# Altium project BABA03A.PrjPcb
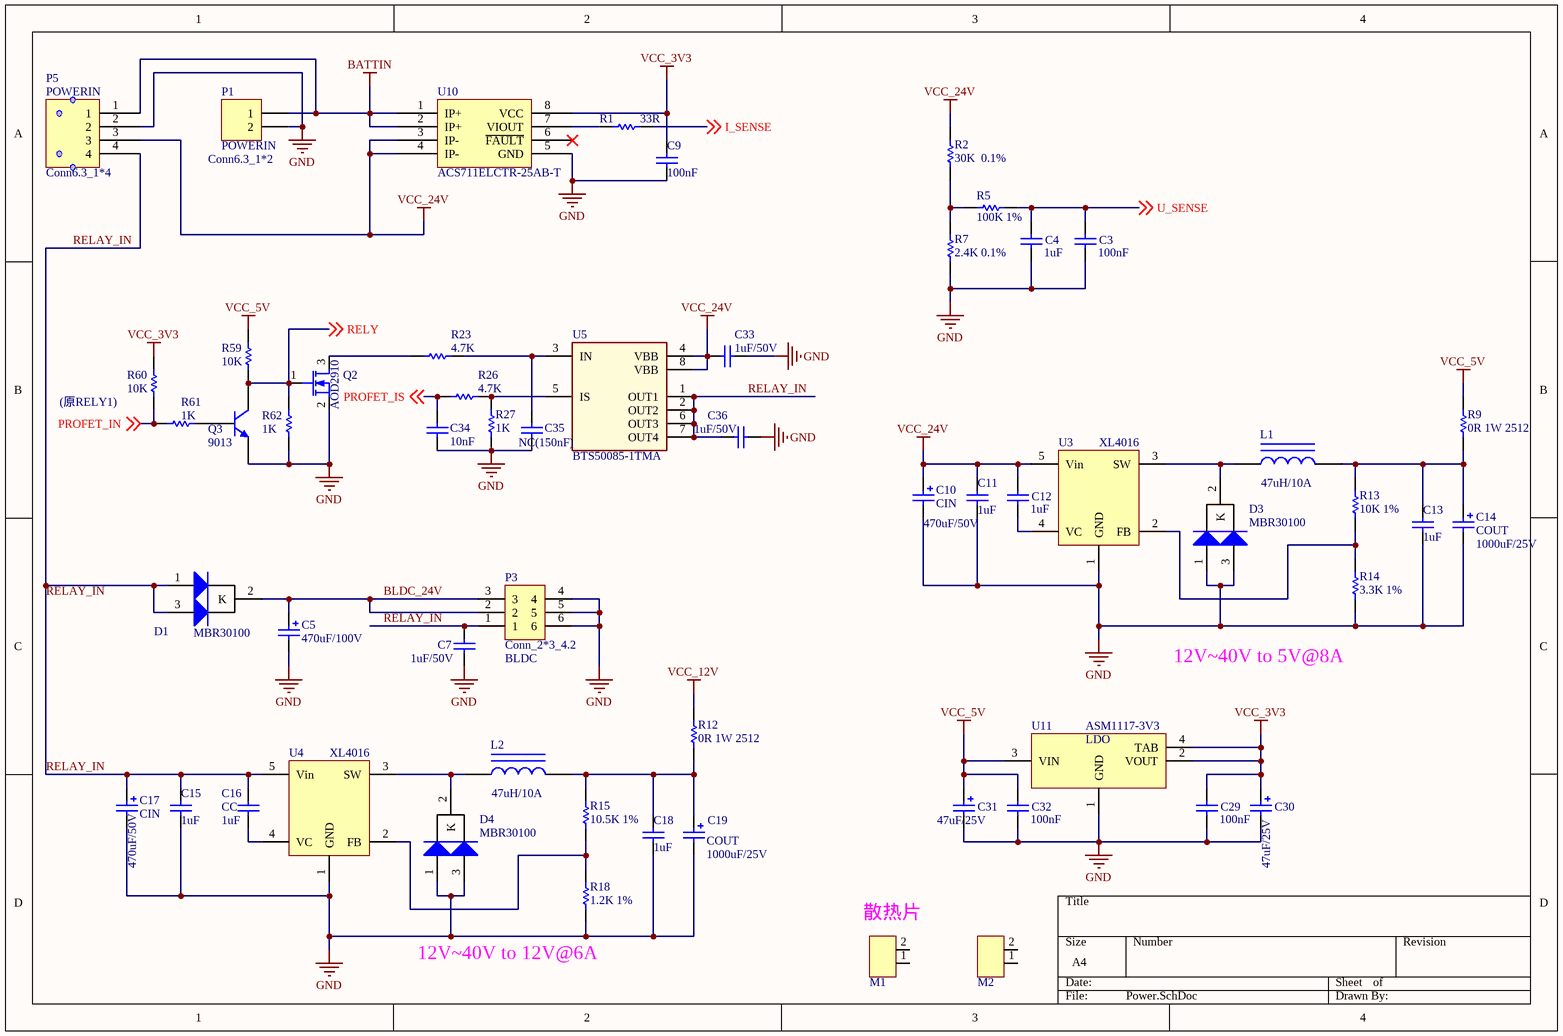
[diagram p0: Power.SchDoc]
3 sheets, 178 parts. Net scope: global (net labels, ports and power ports of the same name join across sheets).
Board file: BABA03A.PcbDoc
Sheets:
  Power.SchDoc
  Mcu.SchDoc
  Connector.SchDoc

## Sheet Power.SchDoc
size A4

### Parts
C3  value 100nF  [C0805]  (hidden comment: Cap)
C4  value 1uF  [C0805]  (hidden comment: Cap)
C5  value 470uF/100V  [330uF]  (hidden comment: Cap Pol1)
C7  value 1uF/50V  [C0805]  (hidden comment: Cap)
C9  value 100nF  [C0805]  (hidden comment: Cap)
C10  CIN  value 470uF/50V  [CTH-R5-D5]
C11  value 1uF  [C0805]  (hidden comment: Cap)
C12  value 1uF  [C0805]  (hidden comment: Cap)
C13  value 1uF  [C0805]  (hidden comment: Cap)
C14  COUT  value 1000uF/25V  [CTH-R5-D5]
C15  value 1uF  [C0805]  (hidden comment: Cap)
C16  value 1uF  [C0805]  (hidden comment: Cap)
C17  CIN  value 470uF/50V  [CTH-R5-D5]
C18  value 1uF  [C0805]  (hidden comment: Cap)
C19  COUT  value 1000uF/25V  [CTH-R5-D5]
C29  value 100nF  [C0805]  (hidden comment: Cap)
C30  value 47uF/25V  [CTH-R3-D2.54]  (hidden comment: Cap Pol1)
C31  value 47uF/25V  [CTH-R3-D2.54]  (hidden comment: Cap Pol1)
C32  value 100nF  [C0805]  (hidden comment: Cap)
C33  value 1uF/50V  [C0805]  (hidden comment: Cap)
C34  value 10nF  [C0805]  (hidden comment: Cap)
C35  value NC(150nF)  [C0805]  (hidden comment: Cap)
C36  value 1uF/50V  [C0805]  (hidden comment: Cap)
D1  MBR30100  [TO-263-3]
D3  MBR30100  [TO-263-3]
D4  MBR30100  [TO-263-3]
L1  value 47uH/10A  [L2210]  (hidden comment: Inductor Iron)
L2  value 47uH/10A  [L2210]  (hidden comment: Inductor Iron)
M1  SRP  [SRP-2-15*10]  (value not drawn)
M2  SRP  [SRP-2-15*10]  (value not drawn)
P1  POWERIN  [DIP2*6.3]
P3  Conn_2*3_4.2  Conn4.2: BLDC  [PIN2X3_4.2]
P5  POWERIN  [PORT-SIP4-6.3-LOCK]
Q2  AOD2910  [TO252-D]
Q3  9013  [BCY-W3/E4]
R1  value 33R  [R0805]  (hidden comment: Res1)
R2  value 30K  0.1%  [R0805]  (hidden comment: Res1)
R5  value 100K 1%  [R0805]  (hidden comment: Res1)
R7  value 2.4K 0.1%  [R0805]  (hidden comment: Res1)
R9  value 0R 1W 2512  [2512]  (hidden comment: Res1)
R12  value 0R 1W 2512  [2512]  (hidden comment: Res1)
R13  value 10K 1%  [R0805]  (hidden comment: Res1)
R14  value 3.3K 1%  [R0805]  (hidden comment: Res1)
R15  value 10.5K 1%  [R0805]  (hidden comment: Res1)
R18  value 1.2K 1%  [R0805]  (hidden comment: Res1)
R23  value 4.7K  [R0805]  (hidden comment: Res1)
R26  value 4.7K  [R0805]  (hidden comment: Res1)
R27  value 1K  [R0805]  (hidden comment: Res1)
R59  value 10K  [R0805]  (hidden comment: Res1)
R60  value 10K  [R0805]  (hidden comment: Res1)
R61  value 1K  [R0805]  (hidden comment: Res1)
R62  value 1K  [R0805]  (hidden comment: Res1)
U3  XL4016  [TO220-5]
U4  XL4016  [TO220-5]
U5  BTS50085-1TMA  [TO127P1385X450-8N-V]
U10  ACS711ELCTR-25AB-T  [ACS712-SOIC8]
U11  ASM1117-3V3  [ASM1117-3V3]

### Nets
BATTIN: P1.1 P5.1 U10.1(IP+) U10.2(IP+)
GND: C3.1 C4.1 C5.2 C7.2 C9.1 C10.2 C11.1 C13.1 C14.2 C15.1 C17.2 C18.1 C19.2 C29.1 C30.2 C31.2 C32.1 C33.1 C34.2 C35.2 C36.1 D3.1(A) D3.3(A) D4.1(A) D4.3(A) P1.2 P3.4 P3.5 P3.6 P5.2 Q2.2(S) Q3.1(E) R7.2 R14.2 R18.2 R27.1 R62.2 U3.1(GND) U4.1(GND) U10.5(GND) U11.1(GND)
VCC_3V3: C9.2 C29.2 C30.1 R60.1 U10.8(VCC) U11.2(VOUT) U11.4(TAB)
VCC_5V: C31.1 C32.2 R9.1 R59.1 U11.3(VIN)
VCC_12V: R12.1
VCC_24V: C10.1 C11.2 C12.2 C33.2 P5.3 R2.1 U3.5(Vin) U5.4(VBB) U5.8(VBB) U10.3(IP-) U10.4(IP-)
BLDC_24V: C5.1 D1.2(K) P3.2 P3.3
I_SENSE: R1.1 ; off-sheet I_SENSE
PROFET_IN: R60.2 R61.2 ; off-sheet PROFET_IN
PROFET_IS: C34.1 R26.1 ; off-sheet PROFET_IS
RELAY_IN: C7.1 C15.2 C16.2 C17.1 C36.2 D1.1(A) D1.3(A) P3.1 P5.4 U4.5(Vin) U5.1(OUT1) U5.2(OUT2) U5.6(OUT3) U5.7(OUT4)
RELY: Q2.1(G) Q3.3(C) R59.2 R62.1 ; off-sheet RELY
U_SENSE: C3.2 C4.2 R5.2 ; off-sheet U_SENSE
NetC12_1: C12.1 U3.4(VC)
NetC13_2: C13.2 C14.1 L1.2 R9.2 R13.1
NetC16_1: C16.1 U4.4(VC)
NetC18_2: C18.2 C19.1 L2.2 R12.2 R15.1
NetC35_1: C35.1 R23.2 U5.3(IN)
NetD3_2: D3.2(K) L1.1 U3.3(SW)
NetD4_2: D4.2(K) L2.1 U4.3(SW)
NetQ2_3: Q2.3(D) R23.1
NetQ3_2: Q3.2(B) R61.1
NetR1_2: R1.2 U10.7(VIOUT)
NetR2_2: R2.2 R5.1 R7.1
NetR13_2: R13.2 R14.1 U3.2(FB)
NetR15_2: R15.2 R18.1 U4.2(FB)
NetR26_2: R26.2 R27.2 U5.5(IS)

Not connected (* = marked no-connect by the designer): M1 1 2; M2 1 2; U10 6(~{FAULT})*

### Notes on the sheet
- (near P1) Conn6.3_1*2
- (原RELY1)
- 12V~40V to 5V@8A
- (near C16) CC
- (near M1) 散热片
- (near R18) 12V~40V to 12V@6A
- (in symbol CONN_4PIN) Conn6.3_1*4

### Library data of the parts
C3 C4 C7 C9 C11-C13 C15 C18 C29 C32-C36 = Cap: Capacitor; Published: 8-Jun-2000; LatestRevisionDate: 17-Jul-2002; LatestRevisionNote: Re-released for DXP Platform.; PackageReference: RAD-0.3; Publisher: Altium Limited; PackageDescription: Radial Cap, Thru-Hole; 2 Leads; 0.3 in Pin Spacing
C5 C10 C14 C17 C19 C30 C31 = Cap Pol1: Polarized Capacitor (Radial); Published: 8-Jun-2000; LatestRevisionDate: 17-Jul-2002; LatestRevisionNote: Re-released for DXP Platform.; PackageReference: RB7.6-15; Publisher: Altium Limited; PackageDescription: Polarized Capacitor (Radial); 2 Leads
C16 = Cap: CC; Published: 8-Jun-2000; LatestRevisionDate: 17-Jul-2002; LatestRevisionNote: Re-released for DXP Platform.; PackageReference: RAD-0.3; Publisher: Altium Limited; PackageDescription: Radial Cap, Thru-Hole; 2 Leads; 0.3 in Pin Spacing
D1 D3 D4 = MBR30100: Dual Diode; Published: 8-Jun-2000; LatestRevisionDate: 17-Jul-2002; LatestRevisionNote: Re-released for DXP Platform.; PackageVersion: Sep-1996; PackageReference: SMC; Publisher: Altium Limited; PackageDescription: DO-214-AB/SMC; 2 C-Bend Leads; Body 7.9 x 5.9 mm, inc. leads (LxW); Code_JEDEC: DO-214-AB
L1 L2 = Inductor Iron: Magnetic-Core Inductor; Published: 24-Mar-1999; LatestRevisionDate: 17-Jul-2002; LatestRevisionNote: Re-released for DXP Platform.; PackageReference: AXIAL-0.9; Publisher: Altium Limited; PackageDescription: Axial Device, Thru-Hole; 2 Leads; 0.9 in Pin Spacing
M1 M2 = SRP-1
P1 = Header 2: Conn6.3_1*2
P5 = CONN_4PIN
Q2 = MOSFET-N: N-Channel MOSFET; Published: 8-Jun-2000; LatestRevisionDate: 17-Jul-2002; LatestRevisionNote: Re-released for DXP Platform.; PackageVersion: 1995/1996; PackageReference: E3; Publisher: Altium Limited; Value: AOD2910
Q3 = 2N3904: NPN General Purpose Amplifier; Published: 8-Jun-2000; LatestRevisionDate: 15-Jan-2003; LatestRevisionNote: PCB Footprint 'BCY-W3/D4.7' replaced; DatasheetVersion: 1997; PackageVersion: Sep-1998; PackageReference: TO-92A; Publisher: Altium Limited; Code_JEDEC: TO-92A; ComponentLink1Description: Manufacturer Link; ComponentLink1URL: http://www.fairchildsemi.com/; ComponentLink2Description: Datasheet; ComponentLink2URL: http://www.fairchildsemi.com/ds/2N%2F2N3904.pdf
R1 R2 R5 R7 R9 R12-R15 R18 R23 R26 R27 R59-R62 = Res1: Resistor; Published: 8-Jun-2000; LatestRevisionDate: 17-Jul-2002; LatestRevisionNote: Re-released for DXP Platform.; PackageReference: AXIAL-0.3; Publisher: Altium Limited; PackageDescription: Axial Device, Thru-Hole; 2 Leads; 0.3 in Pin Spacing
U3 U4 = XL4016: BUCK DCDC; Published: 24-Mar-1999; LatestRevisionDate: 29-May-2009; LatestRevisionNote: IPC-7351 Footprint Added.; PackageReference: D2PAK; Publisher: Altium Limited; PackageDescription: 3-Pin Transistor Outline Package 2.54 mm Pitch, 15.1 mm Lead Span
U5 = BTS50085-1TMA: Smart Highside High Current Power Switch, VBB 70V; Manufacturer: Infineon Technologies; ManufacturerPartNumber: BTS50085-1TMA; PackageReference: PG-TO220-7-4
U10 = ACS711
U11 = LDO

## Sheet Mcu.SchDoc
size A4
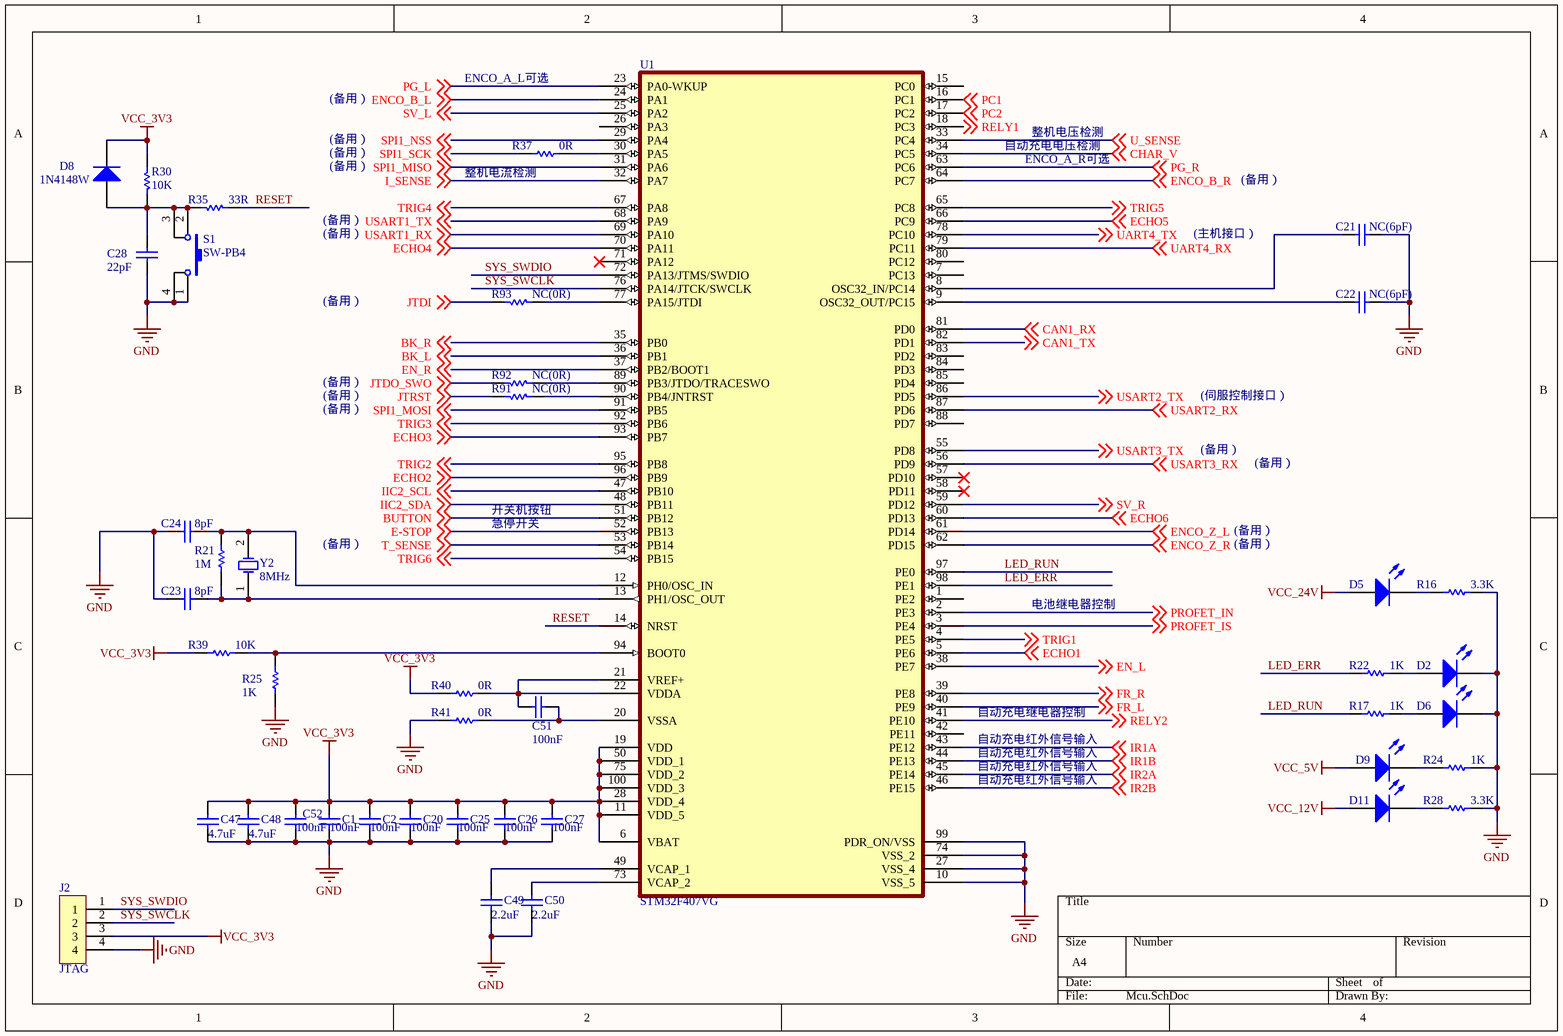
[diagram p1: Mcu.SchDoc]

### Parts
C1  value 100nF  [C0805]  (hidden comment: Cap)
C2  value 100nF  [C0805]  (hidden comment: Cap)
C20  value 100nF  [C0805]  (hidden comment: Cap)
C21  NC(6pF)  [C0805]
C22  NC(6pF)  [C0805]
C23  8pF  [C0805]
C24  8pF  [C0805]
C25  value 100nF  [C0805]  (hidden comment: Cap)
C26  value 100nF  [C0805]  (hidden comment: Cap)
C27  value 100nF  [C0805]  (hidden comment: Cap)
C28  value 22pF  [C0805]  (hidden comment: Cap)
C47  value 4.7uF  [C0805]  (hidden comment: Cap)
C48  value 4.7uF  [C0805]  (hidden comment: Cap)
C49  value 2.2uF  [C0805]  (hidden comment: Cap)
C50  value 2.2uF  [C0805]  (hidden comment: Cap)
C51  value 100nF  [C0805]  (hidden comment: Cap)
C52  value 100nF  [C0805]  (hidden comment: Cap)
D2  LED0  [LED-H-R2.54]  (value not drawn)
D5  LED0  [LED-H-R2.54]  (value not drawn)
D6  LED0  [LED-H-R2.54]  (value not drawn)
D8  value 1N4148W  [1206]  (hidden comment: Diode)
D9  LED0  [LED-H-R2.54]  (value not drawn)
D11  LED0  [LED-H-R2.54]  (value not drawn)
J2  JTAG  [PORT-SIP4-2.54]
R16  value 3.3K  [R0805]  (hidden comment: Res1)
R17  value 1K  [R0805]  (hidden comment: Res1)
R21  value 1M  [R0805]  (hidden comment: Res1)
R22  value 1K  [R0805]  (hidden comment: Res1)
R24  value 1K  [R0805]  (hidden comment: Res1)
R25  value 1K  [R0805]  (hidden comment: Res1)
R28  value 3.3K  [R0805]  (hidden comment: Res1)
R30  value 10K  [R0805]  (hidden comment: Res1)
R35  value 33R  [R0805]  (hidden comment: Res1)
R37  value 0R  [R0805]  (hidden comment: Res1)
R39  value 10K  [R0805]  (hidden comment: Res1)
R40  value 0R  [R0805]  (hidden comment: Res1)
R41  value 0R  [R0805]  (hidden comment: Res1)
R91  value NC(0R)  [R0805]  (hidden comment: Res1)
R92  value NC(0R)  [R0805]  (hidden comment: Res1)
R93  value NC(0R)  [R0805]  (hidden comment: Res1)
S1  SW-PB4  [RESET-SMD-1O4]
U1  STM32F407VG  [100T1_N]
Y2  8MHz  [CLK_3.1]

### Nets
GND: C1.2 C2.2 C20.2 C21.1 C22.1 C23.2 C24.2 C25.2 C26.2 C27.2 C28.1 C47.2 C48.2 C49.2 C50.2 C52.2 D2.2(K) D6.2(K) J2.4 R16.1 R24.1 R25.1 R28.1 R41.2 S1.1 S1.4 U1.10(VSS_5) U1.27(VSS_4) U1.74(VSS_2) U1.99(PDR_ON/VSS)
VCC_3V3: C1.1 C2.1 C20.1 C25.1 C26.1 C27.1 C47.1 C48.1 C52.1 D8.2(K) J2.3 R30.2 R39.2 R40.2 U1.6(VBAT) U1.11(VDD_5) U1.19(VDD) U1.28(VDD_4) U1.50(VDD_1) U1.75(VDD_2) U1.100(VDD_3)
VCC_5V: D9.1(A)
VCC_12V: D11.1(A)
VCC_24V: D5.1(A)
BK_L: U1.36(PB1) ; off-sheet BK_L
BK_R: U1.35(PB0) ; off-sheet BK_R
BUTTON: U1.51(PB12) ; off-sheet BUTTON
CAN1_RX: U1.81(PD0) ; off-sheet CAN1_RX
CAN1_TX: U1.82(PD1) ; off-sheet CAN1_TX
CHAR_V: U1.34(PC5) ; off-sheet CHAR_V
E-STOP: U1.52(PB13) ; off-sheet E-STOP
ECHO1: U1.5(PE6) ; off-sheet ECHO1
ECHO2: U1.96(PB9) ; off-sheet ECHO2
ECHO3: U1.93(PB7) ; off-sheet ECHO3
ECHO4: U1.70(PA11) ; off-sheet ECHO4
ECHO5: U1.66(PC9) ; off-sheet ECHO5
ECHO6: U1.60(PD13) ; off-sheet ECHO6
EN_L: U1.38(PE7) ; off-sheet EN_L
EN_R: U1.37(PB2/BOOT1) ; off-sheet EN_R
ENCO_B_L: U1.24(PA1) ; off-sheet ENCO_B_L
ENCO_B_R: U1.64(PC7) ; off-sheet ENCO_B_R
ENCO_Z_L: U1.61(PD14) ; off-sheet ENCO_Z_L
ENCO_Z_R: U1.62(PD15) ; off-sheet ENCO_Z_R
FR_L: U1.40(PE9) ; off-sheet FR_L
FR_R: U1.39(PE8) ; off-sheet FR_R
I_SENSE: U1.32(PA7) ; off-sheet I_SENSE
IIC2_SCL: U1.47(PB10) ; off-sheet IIC2_SCL
IIC2_SDA: U1.48(PB11) ; off-sheet IIC2_SDA
IR1A: U1.43(PE12) ; off-sheet IR1A
IR1B: U1.44(PE13) ; off-sheet IR1B
IR2A: U1.45(PE14) ; off-sheet IR2A
IR2B: U1.46(PE15) ; off-sheet IR2B
JTDI: R93.2 ; off-sheet JTDI
JTDO_SWO: R92.2 ; off-sheet JTDO_SWO
JTRST: R91.2 ; off-sheet JTRST
LED_ERR: R22.2 U1.98(PE1)
LED_RUN: R17.2 U1.97(PE0)
PC1: U1.16(PC1) ; off-sheet PC1
PC2: U1.17(PC2) ; off-sheet PC2
PG_L: U1.23(PA0-WKUP) ; off-sheet PG_L
PG_R: U1.63(PC6) ; off-sheet PG_R
PROFET_IN: U1.2(PE3) ; off-sheet PROFET_IN
PROFET_IS: U1.3(PE4) ; off-sheet PROFET_IS
RELY1: U1.18(PC3) ; off-sheet RELY1
RELY2: U1.41(PE10) ; off-sheet RELY2
RESET: R35.1 U1.14(NRST)
SPI1_MISO: U1.31(PA6) ; off-sheet SPI1_MISO
SPI1_MOSI: U1.91(PB5) ; off-sheet SPI1_MOSI
SPI1_NSS: U1.29(PA4) ; off-sheet SPI1_NSS
SPI1_SCK: R37.2 ; off-sheet SPI1_SCK
SV_L: U1.25(PA2) ; off-sheet SV_L
SV_R: U1.59(PD12) ; off-sheet SV_R
SYS_SWCLK: J2.2 U1.76(PA14/JTCK/SWCLK)
SYS_SWDIO: J2.1 U1.72(PA13/JTMS/SWDIO)
T_SENSE: U1.53(PB14) ; off-sheet T_SENSE
TRIG1: U1.4(PE5) ; off-sheet TRIG1
TRIG2: U1.95(PB8) ; off-sheet TRIG2
TRIG3: U1.92(PB6) ; off-sheet TRIG3
TRIG4: U1.67(PA8) ; off-sheet TRIG4
TRIG5: U1.65(PC8) ; off-sheet TRIG5
TRIG6: U1.54(PB15) ; off-sheet TRIG6
U_SENSE: U1.33(PC4) ; off-sheet U_SENSE
UART4_RX: U1.79(PC11) ; off-sheet UART4_RX
UART4_TX: U1.78(PC10) ; off-sheet UART4_TX
USART1_RX: U1.69(PA10) ; off-sheet USART1_RX
USART1_TX: U1.68(PA9) ; off-sheet USART1_TX
USART2_RX: U1.87(PD6) ; off-sheet USART2_RX
USART2_TX: U1.86(PD5) ; off-sheet USART2_TX
USART3_RX: U1.56(PD9) ; off-sheet USART3_RX
USART3_TX: U1.55(PD8) ; off-sheet USART3_TX
NetC21_2: C21.2 U1.8(OSC32_IN/PC14)
NetC22_2: C22.2 U1.9(OSC32_OUT/PC15)
NetC23_1: C23.1 R21.1 U1.13(PH1/OSC_OUT) Y2.1(OSC1)
NetC24_1: C24.1 R21.2 U1.12(PH0/OSC_IN) Y2.2(OSC2)
NetC28_2: C28.2 D8.1(A) R30.1 R35.2 S1.2 S1.3
NetC49_1: C49.1 U1.49(VCAP_1)
NetC50_1: C50.1 U1.73(VCAP_2)
NetC51_1: C51.1 R40.1 U1.21(VREF+) U1.22(VDDA)
NetC51_2: C51.2 R41.1 U1.20(VSSA)
NetD2_1: D2.1(A) R22.1
NetD5_2: D5.2(K) R16.2
NetD6_1: D6.1(A) R17.1
NetD9_2: D9.2(K) R24.2
NetD11_2: D11.2(K) R28.2
NetR25_2: R25.2 R39.1 U1.94(BOOT0)
NetR37_1: R37.1 U1.30(PA5)
NetR91_1: R91.1 U1.90(PB4/JNTRST)
NetR92_1: R92.1 U1.89(PB3/JTDO/TRACESWO)
NetR93_1: R93.1 U1.77(PA15/JTDI)

Not connected (* = marked no-connect by the designer): U1 1(PE2) 7(PC13) 15(PC0) 26(PA3) 42(PE11) 57(PD10)* 58(PD11)* 71(PA12)* 80(PC12) 83(PD2) 84(PD3) 85(PD4) 88(PD7)

### Notes on the sheet
- (备用）
- ENCO_A_L可选
- (near R37) 整机电流检测
- 自动充电电压检测
- ENCO_A_R可选
- 整机电压检测
- (主机接口）
- (伺服控制接口）
- 开关机按钮
- 急停开关
- 电池继电器控制
- 自动充电继电器控制
- 自动充电红外信号输入

### Library data of the parts
C1 C2 C20-C28 C47-C52 = Cap: Capacitor; Published: 8-Jun-2000; LatestRevisionDate: 17-Jul-2002; LatestRevisionNote: Re-released for DXP Platform.; PackageReference: RAD-0.3; Publisher: Altium Limited; PackageDescription: Radial Cap, Thru-Hole; 2 Leads; 0.3 in Pin Spacing
  C21 C22: Value: NC(6pF)
  C23 C24: Value: 8pF
D2 D5 D6 D9 D11 = LED0: 发光二极管; Published: 8-Jun-2000; LatestRevisionDate: 08-Jul-2005; LatestRevisionNote: Mech Layer 1 removed.; PackageReference: LED-0; Publisher: Altium Limited
D8 = Diode: 二极管; Type: S01575; Published: 8-Jun-2000; LatestRevisionDate: 17-Jul-2002; LatestRevisionNote: Re-released for DXP Platform.; PackageDocument: Sep-1996; PackageReference: CD1206; Publisher: Altium Limited; Code_JEDEC: DO-214-AB
J2 = Conn_1*4_1
R16 R17 R21 R22 R24 R25 R28 R30 R35 R37 R39-R41 R91-R93 = Res1: Resistor; Published: 8-Jun-2000; LatestRevisionDate: 17-Jul-2002; LatestRevisionNote: Re-released for DXP Platform.; PackageReference: AXIAL-0.3; Publisher: Altium Limited; PackageDescription: Axial Device, Thru-Hole; 2 Leads; 0.3 in Pin Spacing
S1 = SW-PB4: 微动开关; Published: 24-Mar-1999; LatestRevisionDate: 17-Jul-2002; LatestRevisionNote: Re-released for DXP Platform.; PackageReference: SPST-2; Publisher: Altium Limited
Y2 = XTAL: X1A0000610030xx; Published: 8-Jun-2000; LatestRevisionDate: 17-Jul-2002; LatestRevisionNote: Re-released for DXP Platform.; PackageReference: R38; Publisher: Altium Limited; PackageDescription: Crystal, Thru-Hole; 2 Leads; Body 3.1 x 8.2 mm (Dia.xH)

## Sheet Connector.SchDoc
size A4
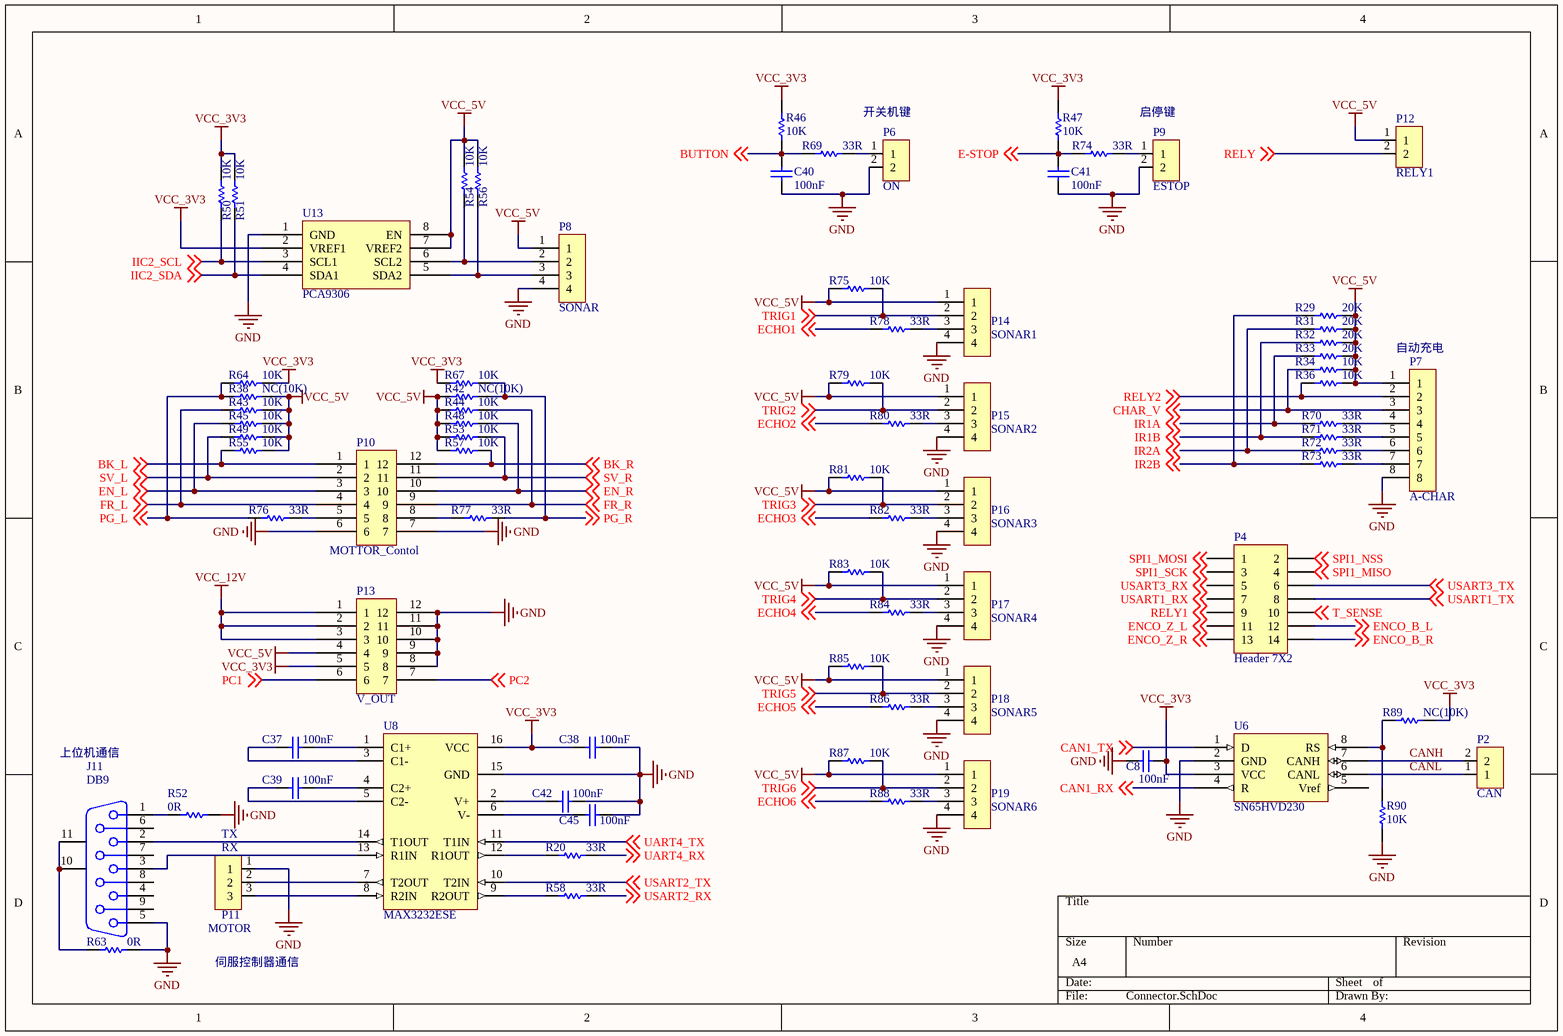
[diagram p2: Connector.SchDoc]

### Parts
C8  value 100nF  [C0805]  (hidden comment: Cap)
C37  value 100nF  [C0805]  (hidden comment: Cap)
C38  value 100nF  [C0805]  (hidden comment: Cap)
C39  value 100nF  [C0805]  (hidden comment: Cap)
C40  value 100nF  [C0805]  (hidden comment: Cap)
C41  value 100nF  [C0805]  (hidden comment: Cap)
C42  value 100nF  [C0805]  (hidden comment: Cap)
C45  value 100nF  [C0805]  (hidden comment: Cap)
J11  DB9  [DB9-TH-F-Z]
P2  CAN  [XH2.54-2P]
P4  Header 7X2  [HDR2X7]
P6  ON  [XH2.54-2P]
P7  A-CHAR  [XH2.54-8P]
P8  SONAR  [XH2.54-4P]
P9  ESTOP  [XH2.54-2P]
P10  MOTTOR_Contol  [PORT-DIP2X6-3-LOCK]
P11  MOTOR  [XH2.54-3P]
P12  RELY1  [XH2.54-2P]
P13  V_OUT  [PORT-DIP2X6-3-LOCK]
P14  SONAR1  [XH2.54-4P]
P15  SONAR2  [XH2.54-4P]
P16  SONAR3  [XH2.54-4P]
P17  SONAR4  [XH2.54-4P]
P18  SONAR5  [XH2.54-4P]
P19  SONAR6  [XH2.54-4P]
R20  value 33R  [R0805]  (hidden comment: Res1)
R29  value 20K  [R0805]  (hidden comment: Res1)
R31  value 20K  [R0805]  (hidden comment: Res1)
R32  value 20K  [R0805]  (hidden comment: Res1)
R33  value 20K  [R0805]  (hidden comment: Res1)
R34  value 10K  [R0805]  (hidden comment: Res1)
R36  value 10K  [R0805]  (hidden comment: Res1)
R38  value NC(10K)  [R0805]  (hidden comment: Res1)
R42  value NC(10K)  [R0805]  (hidden comment: Res1)
R43  value 10K  [R0805]  (hidden comment: Res1)
R44  value 10K  [R0805]  (hidden comment: Res1)
R45  value 10K  [R0805]  (hidden comment: Res1)
R46  value 10K  [R0805]  (hidden comment: Res1)
R47  value 10K  [R0805]  (hidden comment: Res1)
R48  value 10K  [R0805]  (hidden comment: Res1)
R49  value 10K  [R0805]  (hidden comment: Res1)
R50  value 10K  [R0805]  (hidden comment: Res1)
R51  value 10K  [R0805]  (hidden comment: Res1)
R52  value 0R  [R0805]  (hidden comment: Res1)
R53  value 10K  [R0805]  (hidden comment: Res1)
R54  value 10K  [R0805]  (hidden comment: Res1)
R55  value 10K  [R0805]  (hidden comment: Res1)
R56  value 10K  [R0805]  (hidden comment: Res1)
R57  value 10K  [R0805]  (hidden comment: Res1)
R58  value 33R  [R0805]  (hidden comment: Res1)
R63  value 0R  [R0805]  (hidden comment: Res1)
R64  value 10K  [R0805]  (hidden comment: Res1)
R67  value 10K  [R0805]  (hidden comment: Res1)
R69  value 33R  [R0805]  (hidden comment: Res1)
R70  value 33R  [R0805]  (hidden comment: Res1)
R71  value 33R  [R0805]  (hidden comment: Res1)
R72  value 33R  [R0805]  (hidden comment: Res1)
R73  value 33R  [R0805]  (hidden comment: Res1)
R74  value 33R  [R0805]  (hidden comment: Res1)
R75  value 10K  [R0805]  (hidden comment: Res1)
R76  value 33R  [R0805]  (hidden comment: Res1)
R77  value 33R  [R0805]  (hidden comment: Res1)
R78  value 33R  [R0805]  (hidden comment: Res1)
R79  value 10K  [R0805]  (hidden comment: Res1)
R80  value 33R  [R0805]  (hidden comment: Res1)
R81  value 10K  [R0805]  (hidden comment: Res1)
R82  value 33R  [R0805]  (hidden comment: Res1)
R83  value 10K  [R0805]  (hidden comment: Res1)
R84  value 33R  [R0805]  (hidden comment: Res1)
R85  value 10K  [R0805]  (hidden comment: Res1)
R86  value 33R  [R0805]  (hidden comment: Res1)
R87  value 10K  [R0805]  (hidden comment: Res1)
R88  value 33R  [R0805]  (hidden comment: Res1)
R89  value NC(10K)  [R0805]  (hidden comment: Res1)
R90  value 10K  [R0805]  (hidden comment: Res1)
U6  SN65HVD230  [SO8-SN65HVD230]
U8  MAX3232ESE  [SOP16]
U13  PCA9306  [ACS712-SOIC8]

### Nets
GND: C8.1 C38.1 C40.2 C41.2 C42.1 C45.1 J11.5 P6.2 P7.8 P8.4 P9.2 P10.6 P10.7 P11.1 P13.8 P13.9 P13.10 P13.11 P13.12 P14.4 P15.4 P16.4 P17.4 P18.4 P19.4 R52.1 R63.1 R90.2 U6.2(GND) U8.15(GND) U13.1(GND)
VCC_3V3: C8.2 C38.2 P13.5 R46.2 R47.2 R50.2 R51.2 R64.2 R67.1 R89.1 U6.3(VCC) U8.16(VCC) U13.2(VREF1)
VCC_5V: P7.1 P8.1 P12.1 P13.4 P14.1 P15.1 P16.1 P17.1 P18.1 P19.1 R29.1 R31.1 R32.1 R33.1 R34.1 R36.1 R38.2 R42.1 R43.2 R44.1 R45.2 R48.1 R49.2 R53.1 R54.1 R55.2 R56.1 R57.1 R75.2 R79.2 R81.2 R83.2 R85.2 R87.2 U13.7(VREF2) U13.8(EN)
VCC_12V: P13.1 P13.2 P13.3
BK_L: P10.1 R55.1 ; off-sheet BK_L
BK_R: P10.12 R57.2 ; off-sheet BK_R
BUTTON: C40.1 R46.1 R69.2 ; off-sheet BUTTON
CAN1_RX: U6.4(R) ; off-sheet CAN1_RX
CAN1_TX: U6.1(D) ; off-sheet CAN1_TX
CANH: P2.2 U6.7(CANH)
CANL: P2.1 U6.6(CANL)
CHAR_V: P7.3 R34.2 ; off-sheet CHAR_V
E-STOP: C41.1 R47.1 R74.2 ; off-sheet E-STOP
ECHO1: R78.2 ; off-sheet ECHO1
ECHO2: R80.2 ; off-sheet ECHO2
ECHO3: R82.2 ; off-sheet ECHO3
ECHO4: R84.2 ; off-sheet ECHO4
ECHO5: R86.2 ; off-sheet ECHO5
ECHO6: R88.2 ; off-sheet ECHO6
EN_L: P10.3 R45.1 ; off-sheet EN_L
EN_R: P10.10 R48.2 ; off-sheet EN_R
ENCO_B_L: P4.12 ; off-sheet ENCO_B_L
ENCO_B_R: P4.14 ; off-sheet ENCO_B_R
ENCO_Z_L: P4.11 ; off-sheet ENCO_Z_L
ENCO_Z_R: P4.13 ; off-sheet ENCO_Z_R
FR_L: P10.4 R43.1 ; off-sheet FR_L
FR_R: P10.9 R44.2 ; off-sheet FR_R
IIC2_SCL: R50.1 U13.3(SCL1) ; off-sheet IIC2_SCL
IIC2_SDA: R51.1 U13.4(SDA1) ; off-sheet IIC2_SDA
IR1A: R33.2 R70.2 ; off-sheet IR1A
IR1B: R32.2 R71.2 ; off-sheet IR1B
IR2A: R31.2 R72.2 ; off-sheet IR2A
IR2B: R29.2 R73.2 ; off-sheet IR2B
PC1: P13.6 ; off-sheet PC1
PC2: P13.7 ; off-sheet PC2
PG_L: R38.1 R64.1 R76.2 ; off-sheet PG_L
PG_R: R42.2 R67.2 R77.1 ; off-sheet PG_R
RELY: P12.2 ; off-sheet RELY
RELY1: P4.9 ; off-sheet RELY1
RELY2: P7.2 R36.2 ; off-sheet RELY2
SPI1_MISO: P4.4 ; off-sheet SPI1_MISO
SPI1_MOSI: P4.1 ; off-sheet SPI1_MOSI
SPI1_NSS: P4.2 ; off-sheet SPI1_NSS
SPI1_SCK: P4.3 ; off-sheet SPI1_SCK
SV_L: P10.2 R49.1 ; off-sheet SV_L
SV_R: P10.11 R53.2 ; off-sheet SV_R
T_SENSE: P4.10 ; off-sheet T_SENSE
TRIG1: P14.2 R75.1 ; off-sheet TRIG1
TRIG2: P15.2 R79.1 ; off-sheet TRIG2
TRIG3: P16.2 R81.1 ; off-sheet TRIG3
TRIG4: P17.2 R83.1 ; off-sheet TRIG4
TRIG5: P18.2 R85.1 ; off-sheet TRIG5
TRIG6: P19.2 R87.1 ; off-sheet TRIG6
UART4_RX: R20.2 ; off-sheet UART4_RX
UART4_TX: U8.11(T1IN) ; off-sheet UART4_TX
USART1_RX: P4.7 ; off-sheet USART1_RX
USART1_TX: P4.8 ; off-sheet USART1_TX
USART2_RX: R58.2 ; off-sheet USART2_RX
USART2_TX: U8.10(T2IN) ; off-sheet USART2_TX
USART3_RX: P4.5 ; off-sheet USART3_RX
USART3_TX: P4.6 ; off-sheet USART3_TX
NetC37_1: C37.1 U8.1(C1+)
NetC37_2: C37.2 U8.3(C1-)
NetC39_1: C39.1 U8.4(C2+)
NetC39_2: C39.2 U8.5(C2-)
NetC42_2: C42.2 U8.2(V+)
NetC45_2: C45.2 U8.6(V-)
NetJ11_1: J11.1 R52.2
NetJ11_2: J11.2 U8.14(T1OUT)
NetJ11_3: J11.3 U8.13(R1IN)
NetJ11_10: J11.10(MH1) J11.11(MH2) R63.2
NetP6_1: P6.1 R69.1
NetP7_4: P7.4 R70.1
NetP7_5: P7.5 R71.1
NetP7_6: P7.6 R72.1
NetP7_7: P7.7 R73.1
NetP8_2: P8.2 R54.2 U13.6(SCL2)
NetP8_3: P8.3 R56.2 U13.5(SDA2)
NetP9_1: P9.1 R74.1
NetP10_5: P10.5 R76.1
NetP10_8: P10.8 R77.2
NetP11_2: P11.2 U8.7(T2OUT)
NetP11_3: P11.3 U8.8(R2IN)
NetP14_3: P14.3 R78.1
NetP15_3: P15.3 R80.1
NetP16_3: P16.3 R82.1
NetP17_3: P17.3 R84.1
NetP18_3: P18.3 R86.1
NetP19_3: P19.3 R88.1
NetR20_1: R20.1 U8.12(R1OUT)
NetR58_1: R58.1 U8.9(R2OUT)
NetR89_2: R89.2 R90.1 U6.8(RS)

Not connected (* = marked no-connect by the designer): J11 4 6 7 8 9; U6 5(Vref)

### Notes on the sheet
- 开关机键
- 启停键
- (near P7) 自动充电
- 上位机通信
- TX
- (near P11) RX
- 伺服控制器通信

### Library data of the parts
C8 C37-C42 C45 = Cap: Capacitor; Published: 8-Jun-2000; LatestRevisionDate: 17-Jul-2002; LatestRevisionNote: Re-released for DXP Platform.; PackageReference: RAD-0.3; Publisher: Altium Limited; PackageDescription: Radial Cap, Thru-Hole; 2 Leads; 0.3 in Pin Spacing
J11 = D Connector 9: 串口; PackageDocument: O; Positions: 9; Gender: Receptacle; Published: 15-Jun-2001; LatestRevisionDate: 17-Jul-2002; LatestRevisionNote: Re-released for DXP Platform.; DatasheetDocument: 1-Sep-1999; PackageReference: 788750; Publisher: Altium Limited; Orientation: Right Angle
P2 P6 P9 P12 = Conn_1*2
P4 = Header 7X2: Header, 7-Pin, Dual row; LatestRevisionDate: 17-Jul-2002; LatestRevisionNote: Re-released for DXP Platform.; Publisher: Altium Limited
P7 = Conn_1*8
P8 P14-P19 = Conn_1*4_1
P10 P13 = Conn_2*6
P11 = Conn_1*3
R20 R29 R31-R34 R36 R38 R42-R58 R63 R64 R67 R69-R90 = Res1: Resistor; Published: 8-Jun-2000; LatestRevisionDate: 17-Jul-2002; LatestRevisionNote: Re-released for DXP Platform.; PackageReference: AXIAL-0.3; Publisher: Altium Limited; PackageDescription: Axial Device, Thru-Hole; 2 Leads; 0.3 in Pin Spacing
U6 = SN65HVD230D
U8 = MAX3232ESE: +5V Powered, Multi-Channel RS-232 Driver/Receiver; Published: 16-Jan-2001; LatestRevisionDate: 29-May-2009; LatestRevisionNote: Component Body Added.; PackageVersion: 1997; PackageReference: PE16A; Publisher: Altium Limited; PackageDescription: DIP, 16-Pin, Row Spacing 7.62 mm, Pitch 2.54 mm; Code_JEDEC: MS-001-BB; ComponentLink1Description: Manufacturer Link; ComponentLink1URL: http://www.maxim-ic.com/; ComponentLink2Description: Datasheet; ComponentLink2URL: http://pdfserv.maxim-ic.com/en/ds/MAX220-MAX249.pdf

## Nets that join several sheets
GND: Power (41 pins), Mcu (30 pins), Connector (31 pins)
VCC_3V3: Power (7 pins), Mcu (21 pins), Connector (13 pins)
VCC_5V: Power (5 pins), Mcu (D9.1), Connector (36 pins)
VCC_12V: Power (R12.1), Mcu (D11.1), Connector (P13.1 P13.2 P13.3)
VCC_24V: Power (11 pins), Mcu (D5.1)
BK_L: Mcu (U1.36), Connector (P10.1 R55.1)
BK_R: Mcu (U1.35), Connector (P10.12 R57.2)
BUTTON: Mcu (U1.51), Connector (C40.1 R46.1 R69.2)
CAN1_RX: Mcu (U1.81), Connector (U6.4)
CAN1_TX: Mcu (U1.82), Connector (U6.1)
CHAR_V: Mcu (U1.34), Connector (P7.3 R34.2)
E-STOP: Mcu (U1.52), Connector (C41.1 R47.1 R74.2)
ECHO1: Mcu (U1.5), Connector (R78.2)
ECHO2: Mcu (U1.96), Connector (R80.2)
ECHO3: Mcu (U1.93), Connector (R82.2)
ECHO4: Mcu (U1.70), Connector (R84.2)
ECHO5: Mcu (U1.66), Connector (R86.2)
ECHO6: Mcu (U1.60), Connector (R88.2)
EN_L: Mcu (U1.38), Connector (P10.3 R45.1)
EN_R: Mcu (U1.37), Connector (P10.10 R48.2)
ENCO_B_L: Mcu (U1.24), Connector (P4.12)
ENCO_B_R: Mcu (U1.64), Connector (P4.14)
ENCO_Z_L: Mcu (U1.61), Connector (P4.11)
ENCO_Z_R: Mcu (U1.62), Connector (P4.13)
FR_L: Mcu (U1.40), Connector (P10.4 R43.1)
FR_R: Mcu (U1.39), Connector (P10.9 R44.2)
I_SENSE: Power (R1.1), Mcu (U1.32)
IIC2_SCL: Mcu (U1.47), Connector (R50.1 U13.3)
IIC2_SDA: Mcu (U1.48), Connector (R51.1 U13.4)
IR1A: Mcu (U1.43), Connector (R33.2 R70.2)
IR1B: Mcu (U1.44), Connector (R32.2 R71.2)
IR2A: Mcu (U1.45), Connector (R31.2 R72.2)
IR2B: Mcu (U1.46), Connector (R29.2 R73.2)
PC1: Mcu (U1.16), Connector (P13.6)
PC2: Mcu (U1.17), Connector (P13.7)
PG_L: Mcu (U1.23), Connector (R38.1 R64.1 R76.2)
PG_R: Mcu (U1.63), Connector (R42.2 R67.2 R77.1)
PROFET_IN: Power (R60.2 R61.2), Mcu (U1.2)
PROFET_IS: Power (C34.1 R26.1), Mcu (U1.3)
RELY: Power (Q2.1 Q3.3 R59.2 R62.1), Connector (P12.2)
RELY1: Mcu (U1.18), Connector (P4.9)
RELY2: Mcu (U1.41), Connector (P7.2 R36.2)
SPI1_MISO: Mcu (U1.31), Connector (P4.4)
SPI1_MOSI: Mcu (U1.91), Connector (P4.1)
SPI1_NSS: Mcu (U1.29), Connector (P4.2)
SPI1_SCK: Mcu (R37.2), Connector (P4.3)
SV_L: Mcu (U1.25), Connector (P10.2 R49.1)
SV_R: Mcu (U1.59), Connector (P10.11 R53.2)
T_SENSE: Mcu (U1.53), Connector (P4.10)
TRIG1: Mcu (U1.4), Connector (P14.2 R75.1)
TRIG2: Mcu (U1.95), Connector (P15.2 R79.1)
TRIG3: Mcu (U1.92), Connector (P16.2 R81.1)
TRIG4: Mcu (U1.67), Connector (P17.2 R83.1)
TRIG5: Mcu (U1.65), Connector (P18.2 R85.1)
TRIG6: Mcu (U1.54), Connector (P19.2 R87.1)
U_SENSE: Power (C3.2 C4.2 R5.2), Mcu (U1.33)
UART4_RX: Mcu (U1.79), Connector (R20.2)
UART4_TX: Mcu (U1.78), Connector (U8.11)
USART1_RX: Mcu (U1.69), Connector (P4.7)
USART1_TX: Mcu (U1.68), Connector (P4.8)
USART2_RX: Mcu (U1.87), Connector (R58.2)
USART2_TX: Mcu (U1.86), Connector (U8.10)
USART3_RX: Mcu (U1.56), Connector (P4.5)
USART3_TX: Mcu (U1.55), Connector (P4.6)